# Altium schematic sheet SunS_fixture_EGSE_External_Supply.SchDoc: Connectors
size A4; Author: Michał Gumiela; ProjectName: SunS
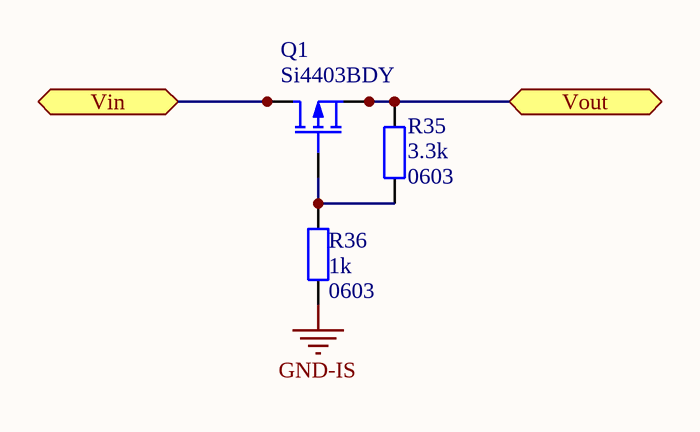
[diagram p0: SunS_fixture_EGSE_External_Supply.SchDoc]

## Parts
Q1  Si4403BDY  [SOIC-8_M]
R35  Package: 0603  [SMD_Resistor_0603]  (hidden comment: 3.3k)
R36  Package: 0603  [SMD_Resistor_0603]  (hidden comment: 1k)

## Ports
Vin, Vout

## Nets
GND-IS: R36.2
Vin: Q1.5(D) Q1.6(D) Q1.7(D) Q1.8(D) ; port Vin
Vout: Q1.1(S) Q1.2(S) Q1.3(S) R35.1 ; port Vout
NetQ1_4: Q1.4(G) R35.2 R36.1

## Notes on the sheet
- Title:
- Project:
- Author:
- Model:
- Document Number:
- Checked by:
- Rev:
- Date:
- Approved by:
- Sheet:
- of
- File name:

## Library data of the parts
Q1 = Si4403BDY: P-Channel 1.8 V (G-S) MOSFET; Manufacturer Part Number: Si4403BDY; value: Si4403BDY
R35 R36 = CRCW06031K00FKxxxx: 1k/1% Vishay CRCW 0603 Resistor. 100mW, 100ppm, 75V.; Manufacturer: Vishay; ManufacturerPartNumber: CRCW06031K00FKxxxx
  R35: Value: 3.3k
  R36: Value: 1k